# Altium schematic sheet CoverPage.SchDoc: =GlobalProjectName
size A3; DocumentNumber: 1; SheetNumber: 1; SheetTotal: 2
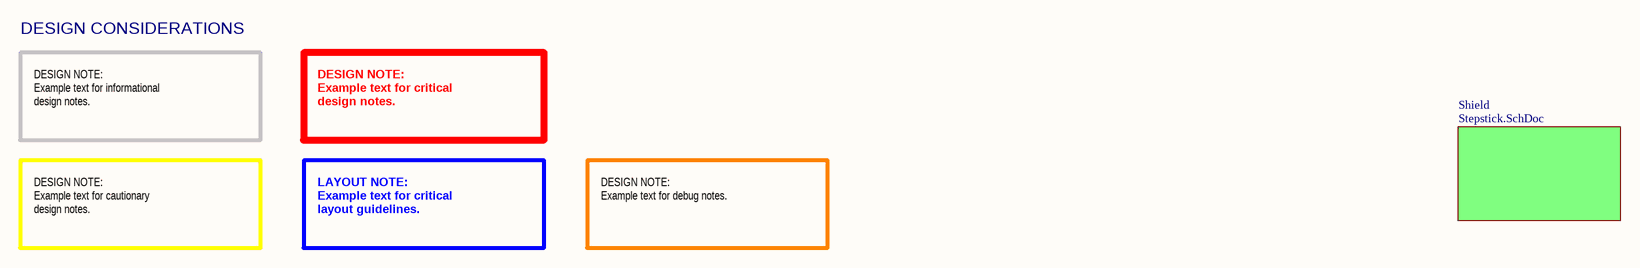
[diagram p0: CoverPage.SchDoc]

## Sub-sheets
Shield = Stepstick.SchDoc: no entries

## Notes on the sheet
- DESIGN CONSIDERATIONS
- DESIGN NOTE:
  Example text for informational
  design notes.
- DESIGN NOTE:
  Example text for critical
  design notes.
- DESIGN NOTE:
  Example text for cautionary
  design notes.
- LAYOUT NOTE:
  Example text for critical
  layout guidelines.
- DESIGN NOTE:
  Example text for debug notes.
- ON Development IVS
- Title:
- Size:
- A3
- Drawn By:
- Date:
- Sheet
- of
- Revision: